# EAGLE board Disco-Cart 2 (EAGLE 9.6.2)
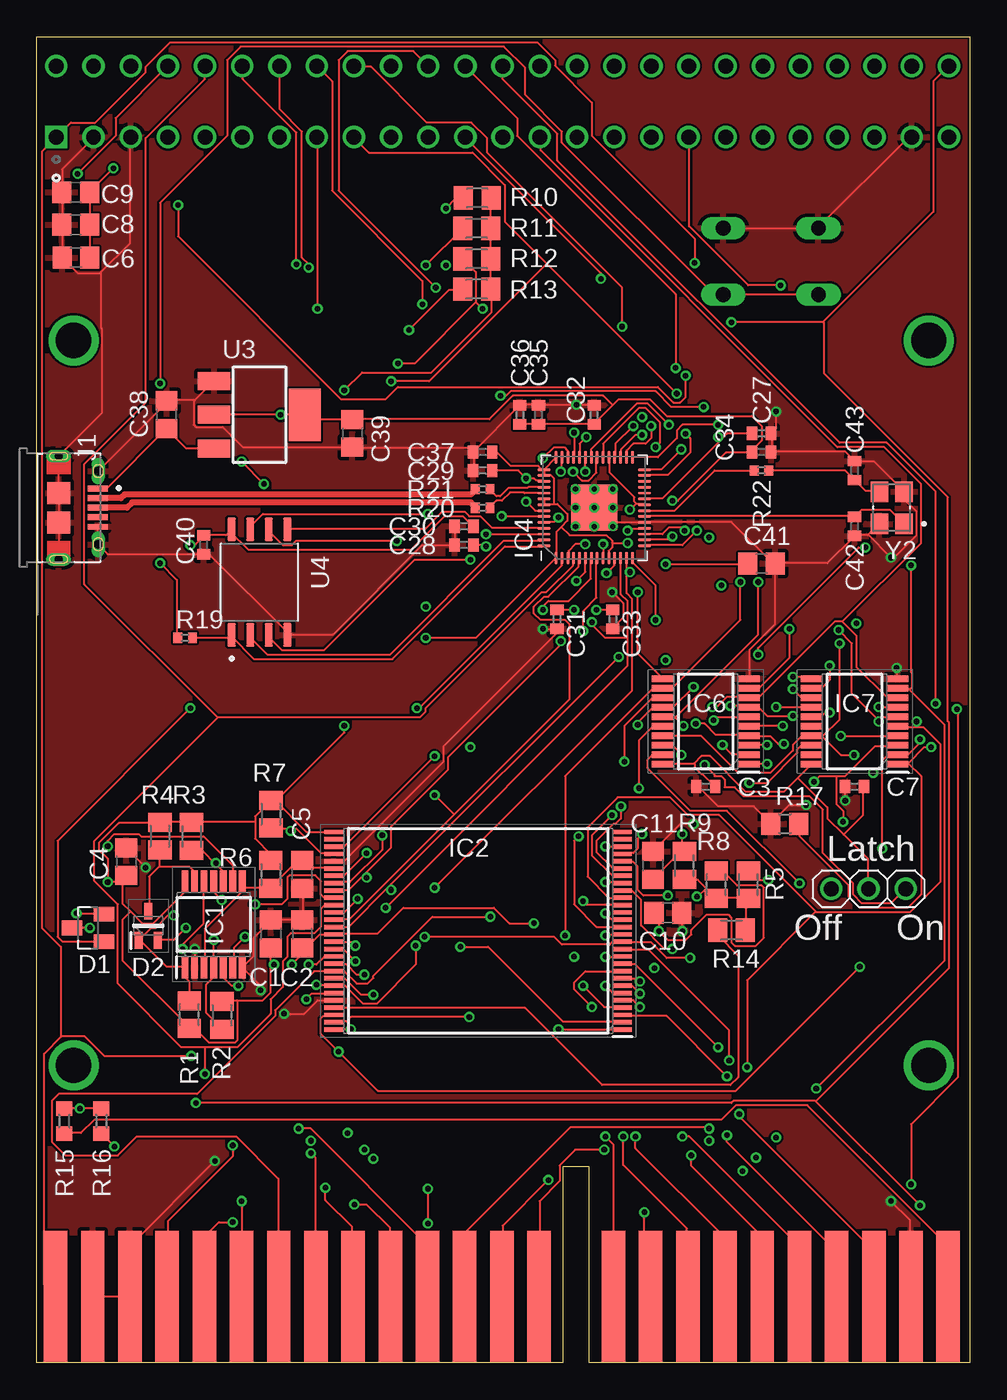
[diagram p3: board, top side]
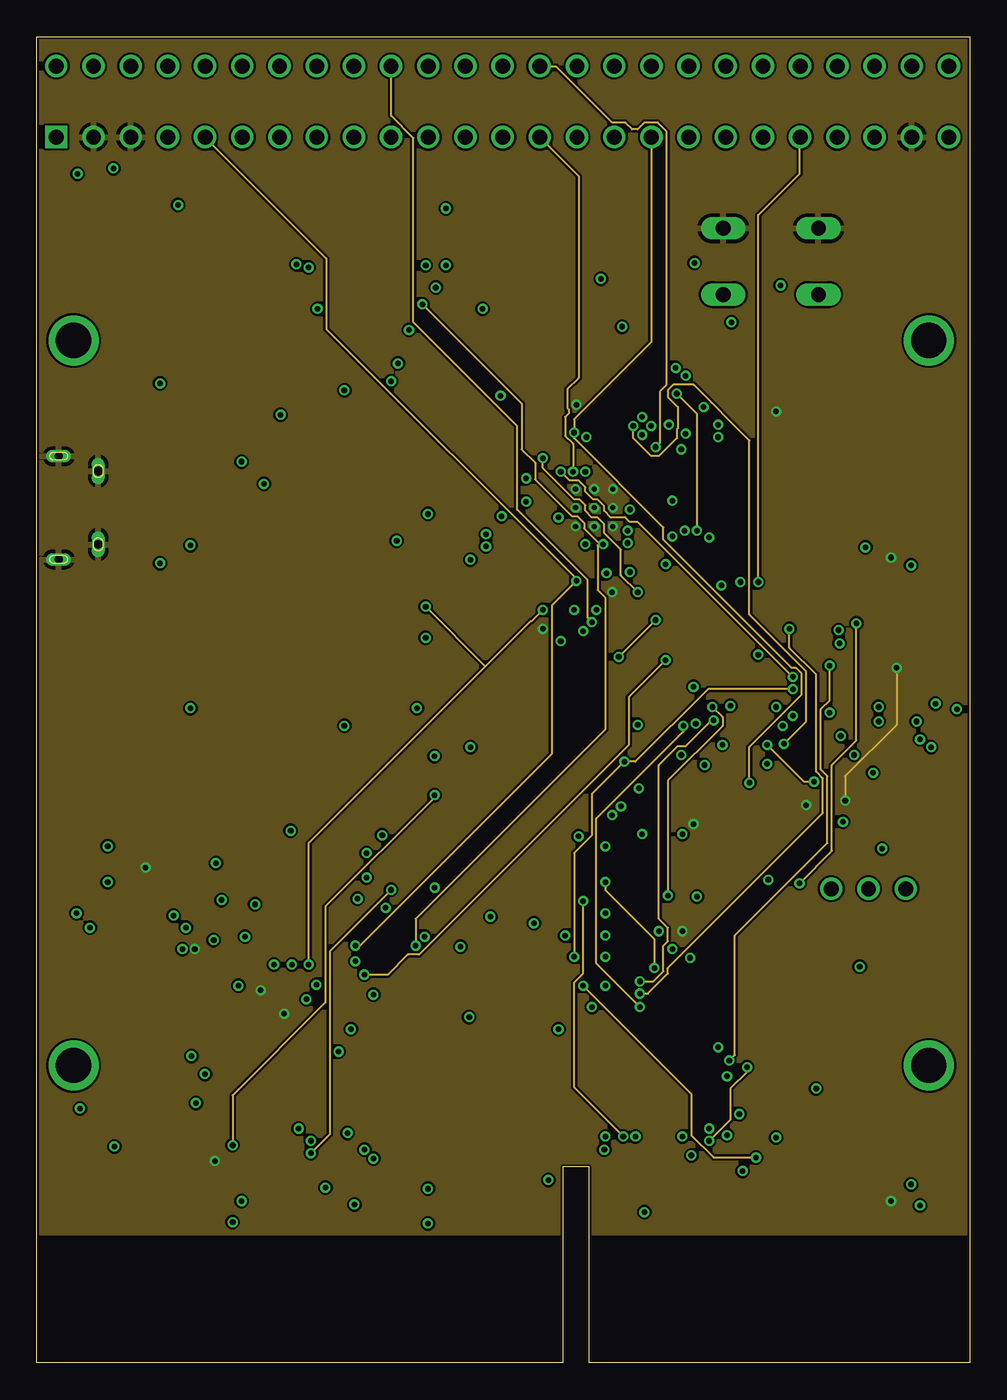
[diagram p4: board, inner layer Route2]
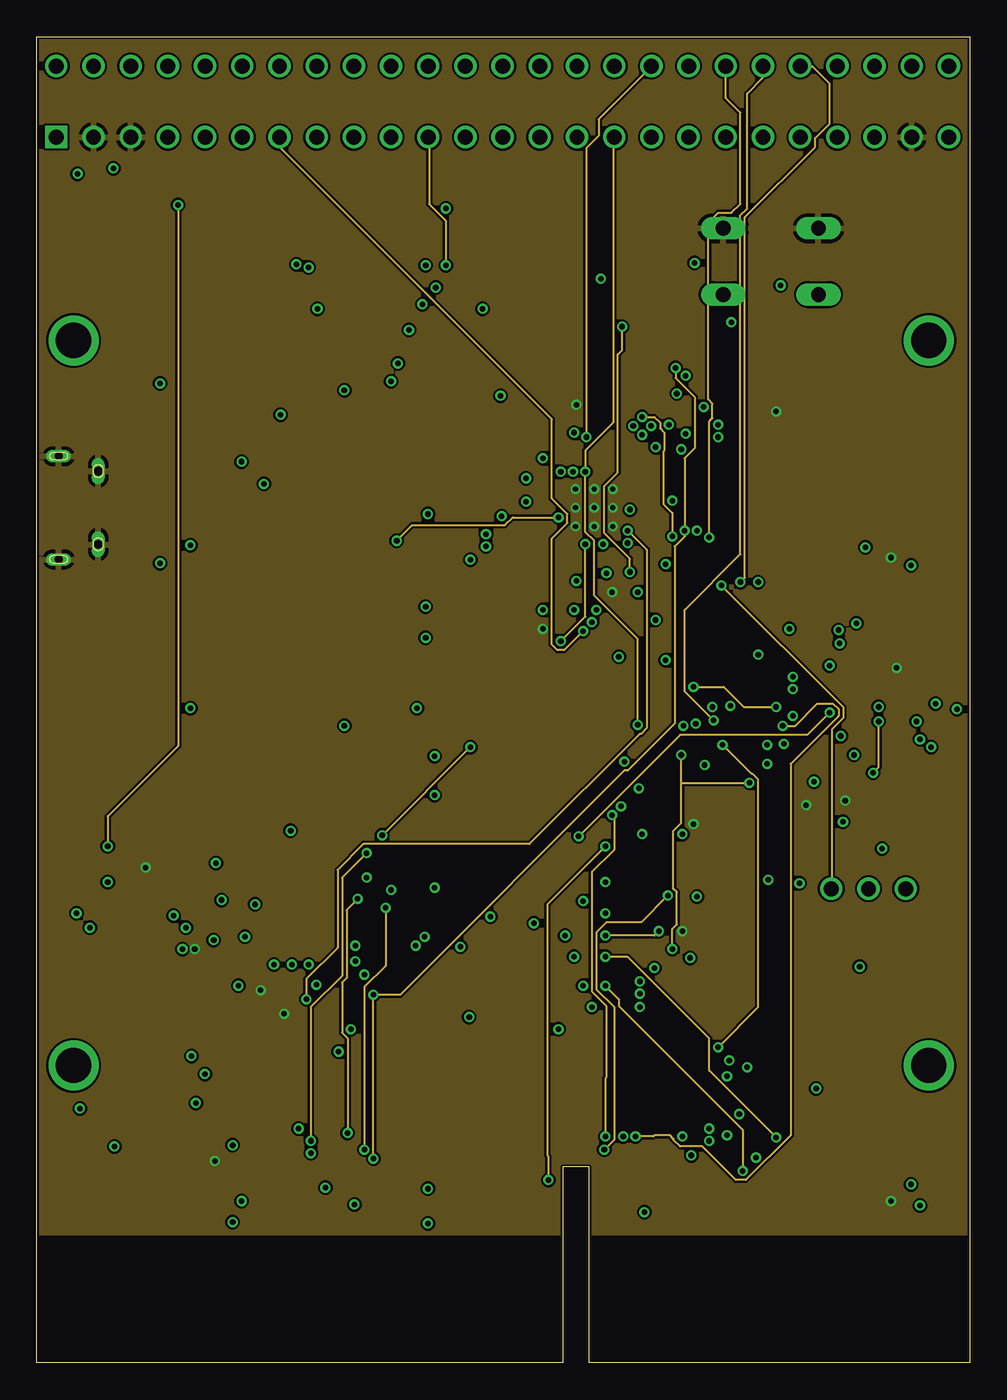
[diagram p5: board, inner layer Route15]
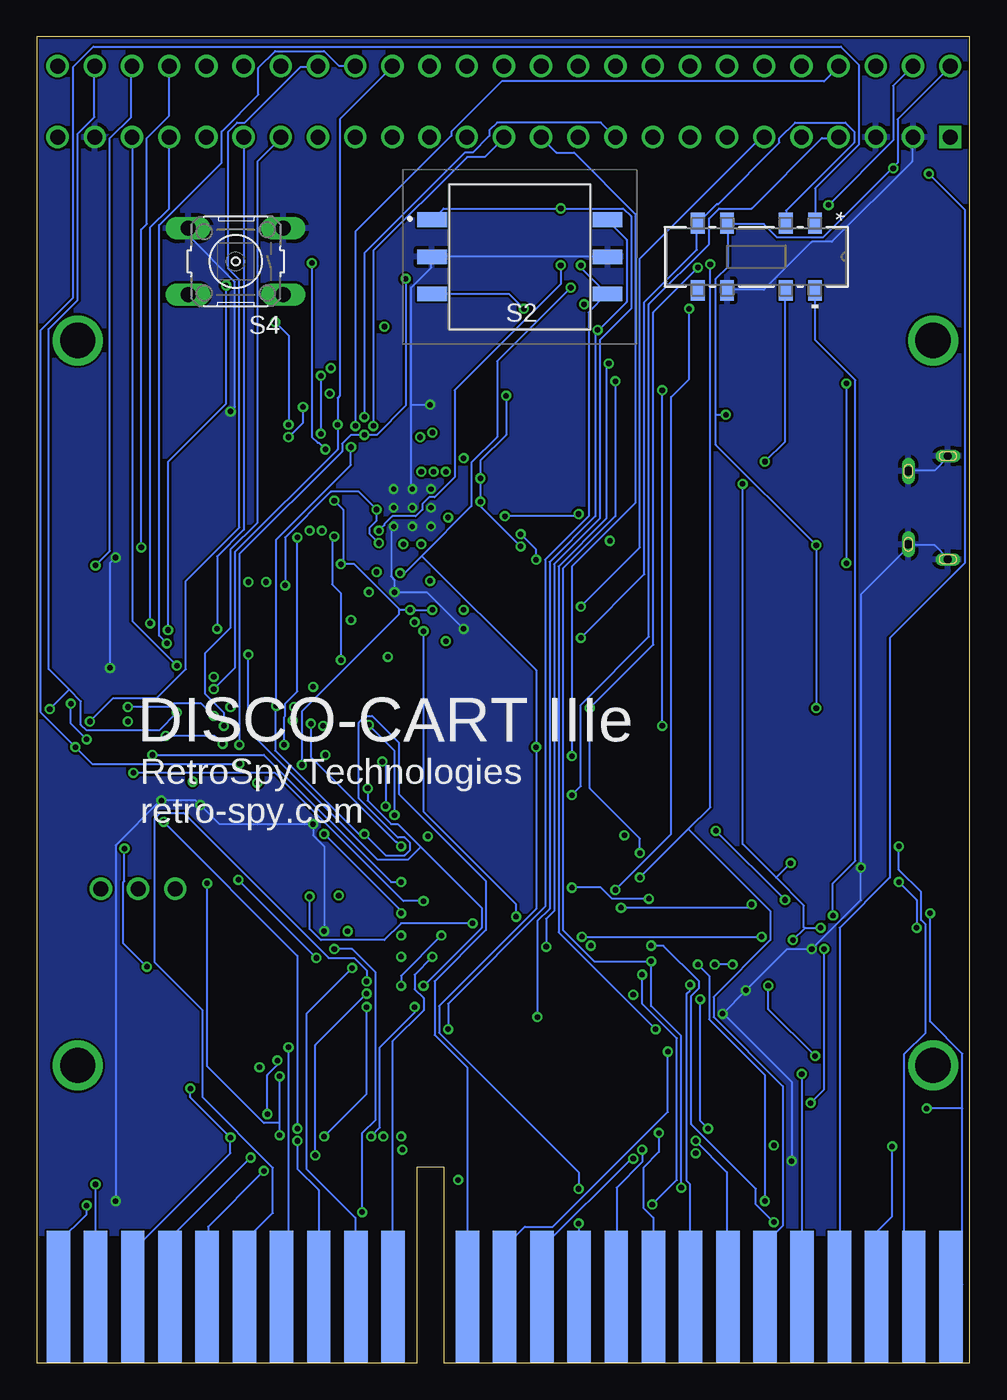
[diagram p6: board, bottom side, seen from below]

Size 63.74 x 90.61 mm. Coordinates in mm from the lower left corner, seen from the top.
Outline: 63.74,0 37.75,0 37.75,13.4 35.95,13.4 35.95,0 0,0 0,90.62 63.74,90.62 63.74,0
Copper layers (1+2*15+16): Top 0.035mm / dielectric 0.11mm / Route2 0.018mm / dielectric 0.6mm / Route15 0.018mm / dielectric 0.11mm / Bottom 0.035mm
Design rules "RetroSpy-2-layer-TIGHT *": minimum track width 6mil, minimum drill 15mil, track to track 6mil, track to pad 6mil, pad to pad 6mil, via to via 6mil, smd to smd 6mil, copper to edge 6mil, drill to drill 6mil, minimum pad ring 6mil, minimum via ring 6mil, stop-mask expansion 4mil, vias tented up to drill 25mil, thermal gap 10mil
Net classes: 1 USB: width 0.406 mm

## Footprints (pad centres in the part's own frame; a part is rotated, then mirrored left to right if it is on the bottom)
C0805 = smd 1.3 x 1.5: 1 -0.95,0; 2 0.95,0
C0402 = smd 0.7 x 0.9: 1 -0.65,0; 2 0.65,0
V.SMILE_CONNECTOR = smd 1.6 x 9: 1 -31.75,0; 2 -29.21,0; 3 -26.67,0; 4 -24.13,0; 5 -21.59,0; 6 -19.05,0; 7 -16.51,0; 8 -13.97,0; 9 -11.43,0; 10 -8.89,0; 11 -6.35,0; 12 -3.81,0; 13 -1.27,0; 14 1.27,0; 15 6.35,0; 16 8.89,0; 17 11.43,0; 18 13.97,0; 19 16.51,0; 20 19.05,0; 21 21.59,0; 22 24.13,0; 23 26.67,0; 24 29.21,0 | smd 1.6 x 9 bottom: 25 -31.75,0; 26 -29.21,0; 27 -26.67,0; 28 -24.13,0; 29 -21.59,0; 30 -19.05,0; 31 -16.51,0; 32 -13.97,0; 33 -11.43,0; 34 -8.89,0; 35 -6.35,0; 36 -3.81,0; 37 -1.27,0; 38 1.27,0; 39 6.35,0; 40 8.89,0; 41 11.43,0; 42 13.97,0; 43 16.51,0; 44 19.05,0; 45 21.59,0; 46 24.13,0; 47 26.67,0; 48 29.21,0
TE_5530843-5 = drill 1.016 square: 1 0,0 | drill 1.016: 2 0,4.851; 3 2.54,0; 4 2.54,4.851; 5 5.08,0; 6 5.08,4.851; 7 7.62,0; 8 7.62,4.851; 9 10.16,0; 10 10.16,4.851; 11 12.7,0; 12 12.7,4.851; 13 15.24,0; 14 15.24,4.851; 15 17.78,0; 16 17.78,4.851; 17 20.32,0; 18 20.32,4.851; 19 22.86,0; 20 22.86,4.851; 21 25.4,0; 22 25.4,4.851; 23 27.94,0; 24 27.94,4.851; 25 30.48,0; 26 30.48,4.851; 27 33.02,0; 28 33.02,4.851; 29 35.56,0; 30 35.56,4.851; 31 38.1,0; 32 38.1,4.851; 33 40.64,0; 34 40.64,4.851; 35 43.18,0; 36 43.18,4.851; 37 45.72,0; 38 45.72,4.851; 39 48.26,0; 40 48.26,4.851; 41 50.8,0; 42 50.8,4.851; 43 53.34,0; 44 53.34,4.851; 45 55.88,0; 46 55.88,4.851; 47 58.42,0; 48 58.42,4.851; 49 60.96,0; 50 60.96,4.851
SOT23 = smd 1 x 1.4: 1 -0.95,-1.1; 2 0.95,-1.1; 3 0,1.1
SOT65P220X100-3N = smd 1.15 x 0.55: 1 -1,0.65; 2 -1,-0.65; 3 1,0
SOP65P640X120-14N = smd 1.475 x 0.45: 1 -2.938,1.95; 2 -2.938,1.3; 3 -2.938,0.65; 4 -2.938,0; 5 -2.938,-0.65; 6 -2.938,-1.3; 7 -2.938,-1.95; 8 2.938,-1.95; 9 2.938,-1.3; 10 2.938,-0.65; 11 2.938,0; 12 2.938,0.65; 13 2.938,1.3; 14 2.938,1.95
SOP50P2000X120-56N = smd 1.3 x 0.3: 1 -9.85,6.75; 2 -9.85,6.25; 3 -9.85,5.75; 4 -9.85,5.25; 5 -9.85,4.75; 6 -9.85,4.25; 7 -9.85,3.75; 8 -9.85,3.25; 9 -9.85,2.75; 10 -9.85,2.25; 11 -9.85,1.75; 12 -9.85,1.25; 13 -9.85,0.75; 14 -9.85,0.25; 15 -9.85,-0.25; 16 -9.85,-0.75; 17 -9.85,-1.25; 18 -9.85,-1.75; 19 -9.85,-2.25; 20 -9.85,-2.75; 21 -9.85,-3.25; 22 -9.85,-3.75; 23 -9.85,-4.25; 24 -9.85,-4.75; 25 -9.85,-5.25; 26 -9.85,-5.75; 27 -9.85,-6.25; 28 -9.85,-6.75; 29 9.85,-6.75; 30 9.85,-6.25; 31 9.85,-5.75; 32 9.85,-5.25; 33 9.85,-4.75; 34 9.85,-4.25; 35 9.85,-3.75; 36 9.85,-3.25; 37 9.85,-2.75; 38 9.85,-2.25; 39 9.85,-1.75; 40 9.85,-1.25; 41 9.85,-0.75; 42 9.85,-0.25; 43 9.85,0.25; 44 9.85,0.75; 45 9.85,1.25; 46 9.85,1.75; 47 9.85,2.25; 48 9.85,2.75; 49 9.85,3.25; 50 9.85,3.75; 51 9.85,4.25; 52 9.85,4.75; 53 9.85,5.25; 54 9.85,5.75; 55 9.85,6.25; 56 9.85,6.75
RP2040-QFN-56 = smd 0.875 x 0.2: 1 -3.438,2.6; 2 -3.438,2.2; 3 -3.438,1.8; 4 -3.438,1.4; 5 -3.438,1; 6 -3.438,0.6; 7 -3.438,0.2; 8 -3.438,-0.2; 9 -3.438,-0.6; 10 -3.438,-1; 11 -3.438,-1.4; 12 -3.438,-1.8; 13 -3.438,-2.2; 14 -3.438,-2.6; 29 3.438,-2.6; 30 3.438,-2.2; 31 3.438,-1.8; 32 3.438,-1.4; 33 3.438,-1; 34 3.438,-0.6; 35 3.438,-0.2; 36 3.438,0.2; 37 3.438,0.6; 38 3.438,1; 39 3.438,1.4; 40 3.438,1.8; 41 3.438,2.2; 42 3.438,2.6 | smd 0.2 x 0.875: 15 -2.6,-3.438; 16 -2.2,-3.438; 17 -1.8,-3.438; 18 -1.4,-3.438; 19 -1,-3.438; 20 -0.6,-3.438; 21 -0.2,-3.438; 22 0.2,-3.438; 23 0.6,-3.438; 24 1,-3.438; 25 1.4,-3.438; 26 1.8,-3.438; 27 2.2,-3.438; 28 2.6,-3.438; 43 2.6,3.438; 44 2.2,3.438; 45 1.8,3.438; 46 1.4,3.438; 47 1,3.438; 48 0.6,3.438; 49 0.2,3.438; 50 -0.2,3.438; 51 -0.6,3.438; 52 -1,3.438; 53 -1.4,3.438; 54 -1.8,3.438; 55 -2.2,3.438; 56 -2.6,3.438 | smd 3.2 x 3.2: 57 0,0 | drill 0.35 pad 0.6: 58 -1.275,1.275; 59 0,1.275; 60 1.275,1.275; 61 -1.275,0; 62 0,0; 63 1.275,0; 64 -1.275,-1.275; 65 0,-1.275; 66 1.275,-1.275
SOP65P640X120-20N = smd 1.475 x 0.45: 1 -2.938,2.925; 2 -2.938,2.275; 3 -2.938,1.625; 4 -2.938,0.975; 5 -2.938,0.325; 6 -2.938,-0.325; 7 -2.938,-0.975; 8 -2.938,-1.625; 9 -2.938,-2.275; 10 -2.938,-2.925; 11 2.938,-2.925; 12 2.938,-2.275; 13 2.938,-1.625; 14 2.938,-0.975; 15 2.938,-0.325; 16 2.938,0.325; 17 2.938,0.975; 18 2.938,1.625; 19 2.938,2.275; 20 2.938,2.925
AMPHENOL_10118194-0001LF = smd 0.4 x 1.35: 1 -1.3,2.675; 2 -0.65,2.675; 3 0,2.675; 4 0.65,2.675; 5 1.3,2.675 | drill 0.6 pad 0.8 long: S1 -2.5,2.7; S2 2.5,2.7 | drill 0.55 pad 0.75 long: S3 -3.525,0; S6 3.525,0 | smd 1.5 x 1.55: S4 -1,0; S5 1,0
1X03 = drill 1.016: 1 -2.54,0; 2 0,0; 3 2.54,0
M0805 = smd 1.3 x 1.6: 1 -0.95,0; 2 0.95,0
R0603 = smd 1 x 1.1: 1 -0.85,0; 2 0.85,0
R0805 = smd 1.3 x 1.5: 1 -0.95,0; 2 0.95,0
R0402 = smd 0.6 x 0.7: 1 -0.5,0; 2 0.5,0
221AMC16R = smd 2 x 1: 1 -6,2.54; 2 6,-2.54; 4 -6,-2.54; 8 6,2.54; C1 -6,0; C2 6,0
B3F-10XX = drill 1.016 long: 1 -3.251,2.261; 2 3.251,2.261; 3 -3.251,-2.261; 4 3.251,-2.261
CL-SB-23B_NDC = smd 1.422 x 0.94: 1 -2.299,4; 2 -2.299,2; 3 -2.299,-2; 4 -2.299,-4; 5 2.299,4; 6 2.299,2; 7 2.299,-2; 8 2.299,-4
SOT223 = smd 1.219 x 2.235: 1 -2.311,-3.099; 2 0,-3.099; 3 2.311,-3.099 | smd 3.6 x 2.2: TAB 0,3.099
SOIC127P790X216-8N = smd 1.61 x 0.58: 1 -3.605,1.905; 2 -3.605,0.635; 3 -3.605,-0.635; 4 -3.605,-1.905; 5 3.605,-1.905; 6 3.605,-0.635; 7 3.605,0.635; 8 3.605,1.905
XTAL_ABM8G-12.000MHZ-4Y-T3 = smd 1.2 x 1.4: 1 -0.85,1.1; 2 -0.85,-1.1; 3 0.85,-1.1; 4 0.85,1.1

## Placement (x,y rotation side)
C1  1uF  [C0805]  16,29.31 90 top
C2  .1uF  [C0805]  18.14,29.31 90 top
C3  .1uF  [C0402]  45.7,39.38 180 top
C4  .1uF  [C0805]  6.13,34.24 90 top
C5  .1uF  [C0805]  18.13,33.37 90 top
C6  10uF  [C0805]  2.69,75.51 180 top
C7  .1uF  [C0402]  55.86,39.38 180 top
C8  1uF  [C0805]  2.67,77.75 180 top
C9  .1uF  [C0805]  2.67,79.97 180 top
C10  .1uF  [C0805]  43.12,30.76 180 top
C11  .1uF  [C0805]  42.1,33.98 270 top
C27  .1uF  [C0402]  49.51,63.51 0 top
C28  .1uF  [C0402]  29.19,55.89 180 top
C29  1uF  [C0402]  30.46,60.97 180 top
C30  .1uF  [C0402]  29.19,57.16 180 top
C31  .1uF  [C0402]  35.54,50.81 270 top
C32  .1uF  [C0402]  38.08,64.78 90 top
C33  .1uF  [C0402]  39.35,50.81 270 top
C34  .1uF  [C0402]  49.51,62.24 0 top
C35  .1uF  [C0402]  34.27,64.78 90 top
C36  .1uF  [C0402]  33,64.78 90 top
C37  1uF  [C0402]  30.46,62.24 180 top
C38  10uF  [C0805]  8.87,64.78 90 top
C39  10uF  [C0805]  21.57,63.51 270 top
C40  .1uF  [C0402]  11.41,55.89 270 top
C41  10uF  [C0805]  49.51,54.62 0 top
C42  15p  [C0402]  55.86,57.16 90 top
C43  15p  [C0402]  55.86,60.97 270 top
CONN1  V.SMILE_CONNECTOR  [V.SMILE_CONNECTOR]  33.05,4.51 0 top
CONN2  5530843-5  [TE_5530843-5]  1.35,83.75 0 top
D1  PMEG2005CT  [SOT23]  3.51,29.72 90 top
D2  MMBD717LT1G  [SOT65P220X100-3N]  7.63,29.86 90 top
IC1  SN74CBTLV3126PW  [SOP65P640X120-14N]  12.1,29.96 90 top
IC2  MT28EW01GABA1HJS-0SIT  [SOP50P2000X120-56N]  30.16,29.52 180 top
IC4  RP2040-QFN56  [RP2040-QFN-56]  38.08,58.43 90 top
IC6  SN74HC373PWR  [SOP65P640X120-20N]  45.7,43.82 180 top
IC7  SN74HC373PWR  [SOP65P640X120-20N]  55.86,43.82 180 top
J1  10118194-0001LF  [AMPHENOL_10118194-0001LF]  1.51,58.43 270 top
JP1  [1X03]  56.81,32.39 0 top
R1  10K  [M0805]  10.42,23.8 270 top
R2  10K  [M0805]  12.65,23.75 90 top
R3  10K  [M0805]  10.58,35.97 90 top
R4  10K  [M0805]  8.42,35.99 90 top
R5  10K  [M0805]  48.61,32.67 270 top
R6  10k  [M0805]  15.99,33.36 90 top
R7  10K  [M0805]  16,37.49 90 top
R8  10K  [M0805]  46.42,32.67 270 top
R9  10K  [M0805]  44.24,33.98 270 top
R10  10K  [M0805]  30.09,79.58 0 top
R11  10K  [M0805]  30.05,77.51 0 top
R12  10K  [M0805]  30.05,75.42 0 top
R13  10K  [M0805]  30.05,73.36 0 top
R14  10K  [M0805]  47.46,29.56 0 top
R15  [R0603]  1.89,16.52 270 top
R16  [R0603]  4.43,16.52 270 top
R17  1k  [R0805]  51.1,36.84 0 top
R19  1k  [R0402]  10.14,49.54 0 top
R20  27  [R0402]  30.46,58.43 180 top
R21  27  [R0402]  30.46,59.7 180 top
R22  1k  [R0402]  49.51,60.97 180 top
S2  221AMC16R  [221AMC16R]  30.75,75.57 0 bottom
S4  [B3F-10XX]  50.15,75.25 180 bottom
SW1  CL-SB-23B-01T  [CL-SB-23B_NDC]  14.59,75.57 270 bottom
U3  NCP1117318H  [SOT223]  15.22,64.78 270 top
U4  W25Q128JVSIM_TR  [SOIC127P790X216-8N]  15.22,53.35 90 top
Y2  ABM8G-12.000MHZ-4Y-T3  [XTAL_ABM8G-12.000MHZ-4Y-T3]  58.4,58.43 180 top

## Tracks (layer width: path | path; a pad name or v marks a point on that pad's centre or on a via)
1OE  (via drill 0.38)
  Top 0.152: v9.36,30.56 8.97,30.56 8.14,29.73 7.83,29.73 6.99,28.89 D2.1 6.99,28.81 7.15,28.81 8.9,27.06 10.12,27.06 IC1.1 10.19,26.98 10.19,26.3 10.42,26.07 10.42,24.77 R1.1
  Bottom 0.152: v9.36,30.56 9.36,32.77 7.83,34.3 7.83,67.14 10.57,69.88 10.57,73.23 SW1.5
2-3OE  (via drill 0.38)
  Top 0.152: 12.21,34.11 11.34,34.98 10.65,34.98 R3.1 | 12.21,34.11 12.71,33.61 12.71,32.92 IC1.10 | v10.19,29.73 9.36,28.89 8.29,28.89 D2.2 | v12.1,28.89 12.1,27.06 IC1.4 12.02,26.98 12.02,26.3 11.56,25.84 11.56,23.93 12.63,22.87 R2.1 | v15.53,60.05 v14,61.58 | v12.25,34.14 12.21,34.11
  Bottom 0.152: v10.19,29.73 11.26,29.73 11.3,29.69 | v12.1,28.89 11.3,29.69 | v14,61.58 12.63,62.95 12.63,73.23 SW1.6 | v15.53,60.05 15.53,35.44 13.24,33.15 | 13.24,33.15 11.34,31.25 11.34,29.73 11.3,29.69 | 13.24,33.15 v12.25,34.14
4OE
  Top 0.152: 8.36,33.92 7.68,33.23 7.68,30.87 D2.3 | 8.36,33.92 8.36,34.98 R4.1 | 8.36,33.92 10.42,33.92 10.73,33.61 10.73,32.92 IC1.13
!BYTE
  Top 0.152: IC2.53 20.33,24.24 33.36,24.24 38.62,18.98 47.38,18.98 47.91,19.51 47.91,27.82 46.54,29.19 46.54,29.5 R14.1
!CE  (via drill 0.38)
  Top 0.152: 17.36,36.51 16.06,36.51 R7.1 | 17.36,36.51 17.74,36.51 19.41,34.83 20.25,34.83 IC2.32 | v12.63,31.63 12.1,32.16 12.1,32.85 IC1.11 | 17.36,36.51 v17.36,36.35
  Bottom 0.152: v17.36,36.35 v12.63,31.63
!LATCH_OE  (via drill 0.38)
  Top 0.152: v61.09,42.07 60.64,42.07 59.53,40.96 | 59.53,40.96 59.49,40.93 58.81,40.93 IC7.1 | v49.89,40.93 48.67,40.93 IC6.1 | 59.53,40.96 60.41,40.09 60.41,32.01 59.49,31.1 56.22,31.1 55.46,31.86 55.46,32.62 52.1,35.97 52.1,36.81 R17.2
  Bottom 0.152: SW1.1 10.57,77.88 10.57,80.25 7.6,83.22 7.6,88.7 8.82,89.92 59.88,89.92 61.25,88.55 61.25,72.78 63.46,70.57 63.46,44.43 v61.09,42.07 59.95,40.93 v49.89,40.93
!OE
  Top 0.152: IC2.34 20.25,33.84 18.65,33.84 18.19,34.3 C5.2 18.12,34.3 17.81,34.3 15.98,32.47 | 14,32.47 14,32.85 IC1.8 14,32.47 | 14,32.47 14,32.16 11.49,29.65 11.49,27.06 IC1.3 | 14,32.47 15.98,32.47 | 15.98,32.47 R6.1
!RST  (via drill 0.38)
  Top 0.152: v38.84,29.19 38.92,29.27 39.99,29.27 IC2.14 | C10.2 42.2,30.72 42.5,30.41 v42.5,29.5 43.11,28.89 44.33,28.89 44.71,29.27 44.71,29.57 45.78,30.64 47.23,30.64 47.46,30.41 47.46,28.73 47.68,28.51 49.13,28.51 49.66,29.04 49.66,32.47 49.51,32.62 47.84,32.62 46.85,33.61 46.46,33.61 R8.1
  Route15 0.152: v38.84,29.19 42.2,29.19 v42.5,29.5
!WE  (via drill 0.38)
  Top 0.152: v44.64,27.67 43.04,27.67 41.97,28.73 40.06,28.73 IC2.13 39.99,28.73 39.3,28.73 39.15,28.58 35.87,28.58 35.34,29.12 v26.5,29.12 | v49.97,33 49.28,33 48.67,33.61 R5.1 | v14.23,29.12 13.47,28.35 13.47,27.06 IC1.6
  Bottom 0.152: v49.97,33 v44.64,27.67 | v26.5,29.12 v14.23,29.12
!WP  (via drill 0.38)
  Top 0.152: v38.84,30.72 39.23,30.34 39.99,30.34 IC2.16 | 44.1,35.06 v44.1,36.13 | 44.1,35.06 44.18,34.98 R9.1 44.1,35.06 | 44.1,35.06 42.12,33.08 C11.2
  Bottom 0.152: v38.84,30.72 38.84,30.87 v44.1,36.13
+1V1  (via drill 0.38)
  Top 0.152: v33.43,58.83 34.04,58.22 34.58,58.22 IC4.50 | IC4.45 34.58,60.28 34.12,60.28 33.97,60.43 v33.43,60.43 32.9,60.97 C29.1 | v30.69,55.78 30.61,55.86 29.85,55.86 C28.1 | 46.73,63.06 47.15,63.48 48.83,63.48 C27.1 | 46.73,63.06 42.73,59.06 41.59,59.06 IC4.23 | v31.68,66.07 32.06,66.07 32.37,66.38 42.27,66.38 43.34,65.31 v45.55,65.31 | 46.73,63.06 v46.54,63.25
  Bottom 0.152: v30.69,55.78 33.43,58.53 v33.43,58.83 v33.43,60.43 33.43,61.65 31.68,63.41 v31.68,66.07 | v45.55,65.31 45.55,64.24 v46.54,63.25
+3V3  (via drill 0.38)
  Top 0.152: 59.27,32.39 JP1.3 58.35,31.4 56.37,31.4 55.76,32.01 55.76,32.77 53.7,34.83 53.7,37.8 52.79,38.72 48.29,38.72 47.68,39.33 47,39.33 47,39.86 46.77,40.09 46.31,40.09 46.31,40.16 v45.63,40.85 | v36.71,51.44 35.57,51.44 C31.1 | v38.23,51.44 39.3,51.44 C33.1 | v42.96,54.57 48.52,54.57 C41.1 | U3.2 v16.67,64.78 U3.TAB 18.35,64.78 18.65,64.47 21.55,64.47 C39.1 21.62,64.47 30.92,64.47 32.52,66.07 38.69,66.07 39.34,65.43 | 32.98,64.09 C36.1 33.05,64.17 34.27,64.17 | 34.27,64.17 38.08,64.17 | 34.27,64.17 C35.1 | 38.08,64.17 39.34,65.43 | 39.34,65.43 39.76,65.84 41.89,65.84 43.04,64.7 48.83,64.7 49.51,64.02 49.51,63.02 48.9,62.41 48.9,62.26 C34.1 48.83,62.19 47.07,62.19 43.8,58.91 v43.42,58.91 | 38.08,64.17 C32.1 | C6.1 3.64,75.52 3.64,77.73 C8.1 3.64,77.81 3.64,79.94 C9.1 3.64,80.02 v5.24,81.62 | C30.1 29.78,57.16 29.09,57.84 27.87,57.84 25.59,55.56 14.46,55.56 13.24,56.78 U4.8 13.32,56.93 12.94,56.55 C40.1 11.41,56.47 10.8,55.86 v10.5,55.86 | v10.5,44.74 1.43,35.67 1.43,29.12 1.74,28.81 4.55,28.81 D1.1
  Bottom 0.152: v36.71,51.44 v38.23,51.44 38.92,51.44 38.96,51.48 | 42.81,54.57 42.04,54.57 38.96,51.48 | 42.81,54.57 42.81,58.3 v43.42,58.91 | 42.81,54.57 v42.96,54.57 | v45.63,40.85 45.63,44.51 39,51.14 39,51.44 38.96,51.48 | 5.28,81.66 4.94,82 4.94,84.97 1.35,88.55 CONN2.2 | 5.28,81.66 10.04,76.89 13.17,76.89 14.08,77.81 16.52,77.81 SW1.3 16.52,77.73 16.52,74.91 17.36,74.07 17.36,64.78 | v5.24,81.62 5.28,81.66 | v10.5,44.74 v10.5,55.86 17.36,62.72 17.36,64.78 | 17.36,64.78 v16.67,64.78
+3V3_LATCH
  Top 0.152: 44.9,40.96 45.4,41.46 46.01,41.46 48.45,39.02 51.04,39.02 51.99,39.97 | 44.9,40.96 44.86,40.93 42.81,40.93 IC6.20 | 51.99,39.97 52.87,40.85 IC7.20 | 55.11,36.09 54.01,37.19 54.01,37.95 51.99,39.97 | 55.11,36.09 56.75,34.45 56.75,32.39 JP1.2 | C3.1 46.31,39.4 45.47,40.24 45.4,40.24 44.94,40.7 44.94,40.93 44.9,40.96 | 55.11,36.09 56.45,37.42 56.45,39.33 C7.1
+3V3_PICO  (via drill 0.38)
  Top 0.152: 40.94,58.72 40.98,58.68 41.51,58.68 IC4.22 | 40.94,58.72 40.83,58.83 40.83,59.14 39.15,60.81 39.15,61.8 IC4.33 | IC4.43 34.65,60.97 34.65,60.66 IC4.44 34.73,60.66 35.11,60.66 35.34,60.43 35.34,58.68 | IC4.42 35.42,61.8 34.65,61.04 IC4.43 | IC4.48 34.65,58.99 34.65,58.68 IC4.49 34.73,58.68 35.34,58.68 | 35.83,57.12 36.25,57.54 36.25,57.99 35.57,58.68 35.34,58.68 | 35.83,57.12 35.49,56.78 35.49,55.02 IC4.1 35.42,54.95 30.01,49.54 v26.58,49.54 | 39.3,56.01 39.3,56.17 38.92,56.55 36.41,56.55 35.83,57.12 | 39.3,56.01 39.3,55.71 39.07,55.48 39.07,55.02 IC4.10 | v40.52,58.3 40.94,58.72 | 39.3,56.01 v40.37,56.01 | C37.1 31.42,62.24 32.37,61.28 34.27,61.28 34.59,60.97 IC4.43
  Route15 0.152: v46.77,53.12 55.08,44.81 55.08,44.05 54.31,43.29 54.31,32.39 JP1.1
  Bottom 0.152: SW1.2 12.56,77.88 12.56,78.72 7.91,83.37 7.91,84.13 8.52,84.74 11.95,84.74 13.01,83.68 13.01,83.37 17.2,79.18 17.28,79.18 18.58,77.88 SW1.4 18.65,77.81 18.65,76.06 22.23,72.47 22.23,53.88 v26.58,49.54 | v40.37,56.01 40.98,56.62 40.98,57.08 40.52,57.54 v40.52,58.3 41.74,59.52 43.65,59.52 46.77,56.39 v46.77,53.12
A0  (via drill 0.38)
  Top 0.152: v41.36,63.41 40.9,63.41 39.91,62.41 39.91,61.88 IC4.31 | v38.54,74.07 38.54,74.45 29.32,83.68 CONN2.23 | v27.19,41.46 21.01,35.29 20.33,35.29 IC2.31 | v49.89,42.22 48.67,42.22 IC6.3 | 54.62,40.09 53.47,40.09 v53.09,39.71 | 54.62,40.09 55.23,40.09 57.28,42.15 58.73,42.15 IC7.3 | CONN1.12 28.93,4.82 28.93,8.58 36.43,16.09 45.85,16.09 v45.93,16.01 | v55.08,36.96 55.08,37.73 54.62,38.18 54.62,40.09
  Route2 0.152: v53.09,39.71 52.41,39.71 v49.89,42.22
  Bottom 0.152: v38.54,74.07 38.54,65.39 40.52,63.41 v41.36,63.41 42.27,63.41 42.88,62.8 42.88,62.26 49.89,55.25 v49.89,42.22 | v27.19,41.46 27.19,54.41 22.84,58.76 22.84,78.49 27.03,82.68 28.25,82.68 29.24,83.68 CONN2.23 | v45.93,16.01 45.93,27.82 v55.08,36.96
A1  (via drill 0.38)
  Top 0.152: v40.75,64.02 39.53,62.8 39.53,61.88 IC4.32 | v38.84,35.29 39.99,35.29 IC2.26 | v45.02,43.67 45.63,43.67 46.39,42.91 48.6,42.91 IC6.4 48.67,42.83 50.12,42.83 50.66,42.3 v51.04,42.3 | v54.92,42.83 58.73,42.83 IC7.4 | v34.96,12.5 31.83,9.38 31.83,4.58 CONN1.13
  Route2 0.152: v40.75,64.02 40.75,63.18 41.97,61.96 42.5,61.96 43.72,63.18 43.72,63.79 43.8,63.86 43.8,65.31 43.11,66 43.11,66.45 43.49,66.83 44.86,66.83 48.67,63.02 48.67,51.14 52.56,47.25 52.56,43.82 v51.04,42.3
  Route15 0.152: v34.96,12.5 34.96,14.1 34.88,14.18 34.88,31.33 v38.84,35.29
  Bottom 0.152: v40.75,64.02 40.75,75.98 34.35,82.38 33.13,82.38 31.83,83.68 CONN2.25 | v38.84,35.29 39.15,35.59 39.23,35.59 45.02,41.38 v45.02,43.67 | v54.92,42.83 51.57,42.83 v51.04,42.3
A2  (via drill 0.38)
  Top 0.152: v42.27,62.57 42.58,62.87 42.58,64.24 41.59,65.23 41.13,65.23 38.69,62.8 38.69,61.88 IC4.34 | v47.38,44.89 48.52,44.89 48.6,44.81 IC6.7 48.67,44.74 49.36,44.74 49.89,44.2 v51.65,44.2 | v41.36,36.13 41.05,35.82 41.05,35.13 40.75,34.83 40.06,34.83 IC2.25 | v57.51,44.81 58.73,44.81 IC7.7
  Route2 0.152: v42.27,62.57 42.58,62.87 42.58,66.38 43.04,66.83 43.04,84.13 42.43,84.74 41.51,84.74 41.05,84.28 40.67,84.28 40.22,84.74 39.3,84.74 35.49,88.55 34.42,88.55 CONN2.28
  Bottom 0.152: v42.27,62.57 42.27,61.35 47.38,56.24 v47.38,44.89 47.46,44.81 47.46,41.84 41.74,36.13 v41.36,36.13 39.91,34.68 38.62,34.68 38.23,35.06 38.23,35.52 38.62,35.9 39.07,35.9 41.74,38.56 41.74,43.75 41.28,44.2 40.83,44.2 39,42.37 39,38.87 33.05,32.92 33.05,29.57 36.56,26.07 36.56,22.41 34.35,20.2 34.35,4.58 CONN1.38 | v57.51,44.81 54.62,44.81 54.39,45.04 52.48,45.04 v51.65,44.2
A3  (via drill 0.38)
  Top 0.152: v36.63,60.89 37.24,60.28 37.7,60.28 38.23,60.81 38.23,61.8 IC4.35 | v43.11,31.94 41.44,31.94 41.05,32.32 41.05,33.92 40.75,34.22 40.06,34.22 IC2.24 | v46.16,44.81 46.46,44.81 47.15,45.5 48.6,45.5 IC6.8 48.67,45.5 49.36,45.5 54.54,50.68 55,50.68 55.04,50.64 | 55.04,50.64 55.99,49.69 55.99,47.56 58.05,45.5 58.73,45.5 IC7.8 | v38.77,14.56 36.79,14.56 35.72,13.49 35.72,12.43 34.35,11.06 34.35,4.58 CONN1.14 | 55.04,50.64 60.41,56.01 60.41,60.05 57.89,62.57 54.69,62.57 34.42,82.84 34.42,83.68 CONN2.27
  Route2 0.152: v36.63,60.89 36.63,62.8 36.1,63.33 36.1,64.62 36.33,64.85 36.33,65.16 36.25,65.23 36.25,66.53 37.02,67.29 37.02,81.08 34.42,83.68 CONN2.27 | v43.11,31.94 43.11,39.78 46.85,43.52 46.85,44.13 v46.16,44.81
  Route15 0.152: v38.77,14.56 39.45,15.25 39.45,24.32 38.23,25.53 38.23,29.42 38.92,30.11 41.28,30.11 v43.11,31.94
A4  (via drill 0.38)
  Top 0.152: v39.91,38.03 39.91,37.19 39.53,36.81 39.38,36.81 38.23,35.67 38.23,34.91 39.3,33.84 39.99,33.84 IC2.23 | v40.14,41.08 40.14,43.52 42.04,45.42 42.73,45.42 IC6.13 | v43.19,64.09 41.74,65.54 40.98,65.54 37.85,62.41 37.85,61.88 IC4.36 | v51.65,46.03 52.18,45.5 52.87,45.5 IC7.13
  Route2 0.152: v51.65,46.03 45.85,46.03 40.9,41.08 v40.14,41.08 37.93,38.87 37.93,36.05 36.71,34.83 v36.71,27.74
  Bottom 0.152: v39.91,38.03 39.91,40.85 v40.14,41.08 | CONN2.32 39.45,88.55 43.04,84.97 43.04,66.07 43.19,65.92 v43.19,64.09 43.19,62.41 50.2,55.4 50.2,47.48 v51.65,46.03 | v36.71,27.74 37.93,26.53 37.93,25.53 37.32,24.92 37.32,24.09 39.45,21.95 39.45,4.58 CONN1.39
A5  (via drill 0.38)
  Top 0.152: v37.47,60.89 37.47,61.8 IC4.37 | v39.3,37.42 37.93,36.05 37.93,34.68 39.3,33.31 39.99,33.31 IC2.22 | v41.05,43.59 41.05,43.75 42.04,44.74 42.73,44.74 IC6.14 42.81,44.81 43.49,44.81 v44.86,46.18 | v50.5,44.81 52.87,44.81 IC7.14 | v38.84,15.48 39.38,14.94 39.38,4.58 CONN1.15
  Route15 0.152: CONN2.31 39.38,83.68 39.38,64.24 37.47,62.34 v37.47,60.89 37.47,56.78 38.08,56.17 38.08,52.43 41.05,49.46 v41.05,43.59 | v50.5,44.81 48.29,44.81 46.92,46.18 v44.86,46.18 | v38.84,15.48 38.84,19.44 38.92,19.51 38.92,24.39 37.93,25.38 37.93,33.53 39.45,35.06 39.45,37.27 v39.3,37.42
  Bottom 0.152: v39.3,37.42 39.3,41.84 v41.05,43.59
A6  (via drill 0.38)
  Top 0.152: v37.55,63.25 37.09,62.8 37.09,61.88 IC4.38 | v38.84,32.85 39.99,32.85 IC2.21 | v55.84,41.54 54.92,41.54 53.67,42.79 | 53.67,42.79 53.63,42.83 52.94,42.83 IC7.17 52.87,42.83 52.26,42.83 51.65,42.22 51.65,41.84 50.12,40.32 47.91,40.32 45.4,42.83 42.81,42.83 IC6.17 | v54.85,49.16 54.85,43.97 53.67,42.79
  Route2 0.152: v42.2,26.98 42.2,28.96 38.84,32.32 v38.84,32.85
  Route15 0.152: v37.55,63.25 37.55,82.99 38.39,83.83 38.39,84.97 41.97,88.55 CONN2.34
  Bottom 0.152: v38.84,32.85 39.53,32.85 48.22,41.54 v55.84,41.54 | v42.2,26.98 45.32,23.86 45.32,13.27 41.97,9.91 41.97,4.58 CONN1.40 | v54.85,49.16 55.38,49.69 55.38,77.73 51.11,82 51.11,84.13 48.6,86.65 48.6,88.48 47.46,89.62 44.1,89.62 43.11,88.63 42.04,88.63 CONN2.34
A7  (via drill 0.38)
  Top 0.152: v36.71,63.56 36.71,61.88 IC4.39 | v43.42,28.28 42.88,28.28 41.28,29.88 41.28,31.63 40.67,32.24 40.06,32.24 IC2.20 | v41.51,10.29 41.51,4.96 41.89,4.58 CONN1.16 | v44.03,41.54 44.03,41.61 43.49,42.15 42.81,42.15 IC6.18 | v48.67,39.63 49.89,39.63 51.95,41.69 51.95,41.92 52.18,42.15 52.87,42.15 IC7.18
  Route2 0.152: CONN2.33 41.97,83.68 41.97,69.73 36.71,64.47 v36.71,63.56 36.71,63.18 42.81,57.08 42.81,56.24 51.57,47.48 51.87,47.48 52.26,47.1 52.26,45.65 48.67,42.07 v48.67,39.63
  Route15 0.152: 44.03,39.63 44.03,36.89 43.49,36.35 43.49,32.39 43.72,32.16 43.72,29.95 43.42,29.65 v43.42,28.28 | 44.03,39.63 v44.03,41.54 | 44.03,39.63 v48.67,39.63
  Bottom 0.152: v43.42,28.28 42.2,28.28 40.6,26.68 40.6,16.62 41.51,15.7 v41.51,10.29
A8  (via drill 0.38)
  Top 0.152: v46.54,21.57 40.9,27.21 40.06,27.21 IC2.10 | v46.85,42.22 47.46,41.61 48.6,41.61 IC6.2
  Route15 0.152: v46.85,42.22 48.83,40.24 48.9,40.24 49.28,39.86 49.28,24.32 v46.54,21.57 | v45.93,56.39 45.93,64.32 46.16,64.55 46.16,65.54 45.85,65.84 45.85,77.88 46.54,78.57 47.46,78.57 48.06,79.18 48.06,85.43 47.07,86.42 47.07,88.55 CONN2.38
  Bottom 0.152: v46.54,21.57 46.54,5.04 47,4.58 CONN1.42 | v45.93,56.39 45.93,45.88 46.77,45.04 46.77,44.2 46.85,44.13 v46.85,42.22
A9  (via drill 0.38)
  Top 0.152: v37.93,24.32 36.71,25.53 36.71,25.99 37.47,26.75 39.99,26.75 IC2.9 | v40.9,15.48 40.9,14.67 47,8.58 47,4.58 CONN1.18 | v50.96,43.52 48.67,43.52 IC6.5
  Route15 0.152: v40.9,15.48 42.12,15.48 42.2,15.55 43.26,15.55 43.49,15.32 43.49,15.25 43.95,14.79 45.47,14.79 47.76,12.5 48.45,12.5 51.49,15.55 51.49,40.93 54.77,44.2 54.77,44.66 54.39,45.04 53.32,45.04 51.8,43.52 v50.96,43.52
  Bottom 0.152: v37.93,24.32 37.93,23.93 40.29,21.57 40.29,16.09 v40.9,15.48 | v50.96,43.52 50.96,44.43 52.26,45.73 52.26,48.47 50.5,50.22 50.5,55.56 48.67,57.39 48.67,82.07 47.07,83.68 CONN2.37
A10  (via drill 0.38)
  Top 0.152: v41.21,26.07 41.05,26.22 40.06,26.22 IC2.8 | v46.24,43.9 46.46,44.13 48.6,44.13 IC6.6
  Route2 0.152: v46.24,43.9 46.08,43.9 44.33,42.15 43.8,42.15 42.5,40.85 42.5,30.34 43.11,29.73 43.11,28.81 42.81,28.51 42.81,26.75 42.12,26.07 v41.21,26.07
  Route15 0.152: v46.24,43.9 44.25,45.88 44.25,51.44 48.06,55.25 48.06,78.42 48.52,78.87 48.52,86.72 49.59,87.79 49.59,88.55 CONN2.40
  Bottom 0.152: v41.21,26.07 41.21,26.83 42.04,27.67 43.8,27.67 53.7,37.57 55.3,37.57 55.68,37.19 55.68,27.36 52.41,24.09 52.41,18.14 47.61,13.34 47.61,10.24 49.51,8.34 49.51,4.58 CONN1.43
A11  (via drill 0.38)
  Top 0.152: v51.42,50.15 51.42,48.16 49.36,46.11 48.67,46.11 IC6.9 | v41.21,25.23 40.67,25.76 40.06,25.76 IC2.7 | v44.71,14.18 44.71,13.46 49.51,8.66 49.51,4.58 CONN1.19
  Route2 0.152: v51.42,50.15 51.42,48.85 53.25,47.02 53.25,40.39 53.7,39.94 53.7,37.57 43.11,26.98 43.11,26.6 41.74,25.23 v41.21,25.23
  Bottom 0.152: v51.42,50.15 51.42,55.1 49.59,56.93 49.59,83.68 CONN2.39 | v41.21,25.23 44.71,21.72 v44.71,14.18
A12  (via drill 0.38)
  Top 0.152: v38.84,25.76 39.3,25.3 39.99,25.3 IC2.6 | v36.1,29.19 36.1,40.09 42.04,46.03 42.73,46.03 IC6.12 42.81,46.11 43.42,46.11 48.06,50.76 v48.06,53.35
  Route15 0.152: v48.06,53.35 48.37,53.65 48.37,78.26 53.17,83.07 53.17,83.68 54.16,84.67 54.16,87.41 53.02,88.55 52.18,88.55 CONN2.42 | v48.22,13.11 48.22,15.93 39.76,24.39 39.76,24.85 v38.84,25.76
  Bottom 0.152: v38.84,25.76 38.84,26.45 v36.1,29.19 | v48.22,13.11 52.03,9.3 52.03,4.58 CONN1.44
A13  (via drill 0.38)
  Top 0.152: v41.21,24.32 40.75,24.77 40.06,24.77 IC2.5 | v44.1,15.48 44.57,15.48 52.03,8.02 52.03,4.58 CONN1.20 | v44.18,43.52 43.61,44.09 | 43.61,44.09 43.57,44.13 42.81,44.13 IC6.15 | v49.28,53.35 49.28,49.77 43.61,44.09
  Route2 0.152: v44.18,43.52 44.18,43.14 38.23,37.19 38.23,27.29 v41.21,24.32 | v49.28,53.35 49.28,78.42 52.1,81.24 52.1,83.68 CONN2.41
  Bottom 0.152: v41.21,24.32 41.21,18.37 v44.1,15.48
A14  (via drill 0.38)
  Top 0.152: v37.32,25.76 38.77,24.32 39.99,24.32 IC2.4 | v41.13,39.25 41.13,42.53 42.04,43.44 42.73,43.44 IC6.16 | v56.6,55.71 56.14,55.71 49.28,48.85 v49.28,48.39
  Route2 0.152: v49.13,14.03 46.24,14.03 44.71,15.55 44.71,18.37 v37.32,25.76
  Bottom 0.152: v37.32,25.76 33.36,29.73 33.36,31.1 37.51,35.25 | 37.51,35.25 39.07,36.81 39.53,36.81 41.13,38.41 v41.13,39.25 | v56.6,55.71 56.6,77.43 56.22,77.81 56.22,83.68 54.69,85.2 54.69,88.55 CONN2.44 | v49.28,48.39 49.28,43.21 40.44,34.37 38.39,34.37 37.51,35.25 | v49.13,14.03 54.62,8.54 54.62,4.58 CONN1.45
A15  (via drill 0.38)
  Top 0.152: v47.15,19.59 43.04,23.71 40.06,23.71 IC2.3 | v47.15,15.55 47.15,15.09 54.62,7.63 54.62,4.58 CONN1.21 | v52.1,32.77 47.15,37.73 44.64,37.73 41.74,40.62 41.74,41.23 42.04,41.54 42.73,41.54 IC6.19
  Route2 0.152: v55.99,50.53 55.99,42.53 54.31,40.85 54.31,34.98 v52.1,32.77
  Bottom 0.152: v47.15,15.55 47.15,16.39 | 47.15,16.39 v47.15,19.59 | v52.1,32.77 52.1,20.28 48.22,16.39 47.15,16.39 | v55.99,50.53 55.99,77.58 54.69,78.87 54.69,83.68 CONN2.43
A16  (via drill 0.38)
  Top 0.152: IC2.54 20.25,23.71 19.57,23.71 19.41,23.55 19.41,22.49 v20.63,21.27 23.3,18.6 47.76,18.6 v56.22,27.06 | v57.74,35.13 57.74,41.16 58.12,41.54 58.73,41.54 IC7.2 58.81,41.61 59.57,41.61 60.33,42.37 v60.33,42.6 | v61.4,45.04 61.4,59.52 58.05,62.87 54.85,62.87 35.57,82.15 35.57,83.98 31.83,87.71 31.83,88.55 CONN2.26
  Bottom 0.152: v20.63,21.27 20.63,17.15 28.48,9.3 30.4,9.3 31.76,7.94 31.76,4.58 CONN1.37 | v57.74,35.13 57.74,32.92 57.82,32.85 57.82,28.66 v56.22,27.06 | v61.4,45.04 61.4,43.67 v60.33,42.6
A17  (via drill 0.38)
  Top 0.152: 53.21,30.83 53.25,30.79 59.65,30.79 61.7,32.85 61.7,42.3 60.56,43.44 60.1,43.44 | 53.21,30.83 46.62,37.42 44.48,37.42 43.26,38.64 39.68,38.64 37.63,36.58 37.63,33.23 39.07,31.78 39.99,31.78 IC2.19 | 60.1,43.44 58.81,43.44 IC7.5 | 60.1,43.44 v60.1,43.82 | v48.52,20.2 48.52,26.14 53.21,30.83
  Route2 0.152: v45.93,15.17 47.38,16.62 47.38,18.75 48.52,19.9 v48.52,20.2
  Bottom 0.152: v60.1,43.82 58.5,45.42 55.53,45.42 53.55,47.4 53.55,53.42 49.89,57.08 49.89,74 50.66,74.76 50.66,84.13 50.05,84.74 49.51,84.74 45.7,88.55 44.56,88.55 CONN2.36 | v45.93,15.17 45.93,13.27 44.48,11.82 44.48,4.58 CONN1.41
A18  (via drill 0.38)
  Top 0.152: v37.32,31.55 37.55,31.33 39.99,31.33 IC2.18 | v40.06,15.48 40.06,13.53 44.41,9.19 44.41,4.58 CONN1.17 | IC7.6 58.73,44.13 57.82,44.13 v57.51,43.82 57.51,43.9 55.68,45.73 55.68,49.16 v54.77,50.07 | v50.81,73.62 48.6,73.62 44.56,77.66 44.56,83.68 CONN2.35
  Route2 0.152: v37.32,31.55 37.32,26.6 36.71,25.99 36.71,18.83 v40.06,15.48
  Route15 0.152: v57.51,43.82 57.51,40.7 v57.13,40.32
  Bottom 0.152: v57.13,40.32 47.46,40.32 38.69,31.55 v37.32,31.55 | v50.81,73.62 50.81,65.54 54.77,61.58 v54.77,50.07
A19  (via drill 0.38)
  Top 0.152: v38.84,27.74 39.99,27.74 IC2.11 | 59.61,45.99 62.01,43.59 62.01,27.52 v53.25,18.75 | 59.61,45.99 59.57,46.03 58.81,46.03 IC7.9 | v59.72,54.49 59.72,47.17 59.8,47.1 59.8,46.18 59.61,45.99
  Route15 0.152: v38.84,27.74 40.37,27.74 45.93,22.18 45.93,19.97 v50.5,15.4
  Bottom 0.152: CONN1.46 57.13,4.58 57.13,7.7 50.5,14.33 v50.5,15.4 53.25,18.14 v53.25,18.75 | v59.72,54.49 58.73,55.48 58.73,83.68 57.28,85.12 57.28,88.55 CONN2.46
A20  (via drill 0.38)
  Top 0.152: v54.16,47.63 54.16,46.64 53.63,46.11 52.94,46.11 IC7.12 | v47.3,20.66 47.3,22.71 41.82,28.2 40.06,28.2 IC2.12 | v47.99,17 47.99,16.85 56.82,8.02 56.82,5.08 CONN1.22
  Route2 0.152: v54.16,47.63 54.16,45.27 53.55,44.66 53.55,40.54 54.01,40.09 54.01,35.52 47.68,29.19 47.68,21.04 v47.3,20.66
  Bottom 0.152: v54.16,47.63 57.21,50.68 57.21,83.68 CONN2.45 | v47.3,20.66 47.3,20.35 47.99,19.67 v47.99,17
A21  (via drill 0.38)
  Top 0.152: v37.02,35.97 36.71,35.67 36.71,31.33 38.23,29.8 39.99,29.8 IC2.15 | v54.16,44.43 53.86,44.43 53.63,44.2 52.94,44.2 IC7.15 | v59.72,12.2 59.72,16.31 62.92,19.51 62.92,44.58 v62.85,44.66
  Route15 0.152: v37.02,35.97 43.95,42.91 52.64,42.91 v54.16,44.43
  Bottom 0.152: 61.51,45.99 60.71,45.19 60.71,43.59 60.33,43.21 55.38,43.21 v54.16,44.43 | 61.51,45.99 62.92,47.4 62.92,70.64 60.94,72.63 60.94,83.98 59.8,85.12 59.8,88.55 CONN2.48 | v59.72,12.2 59.72,4.58 CONN1.47 | 61.51,45.99 v62.85,44.66
A22  (via drill 0.38)
  Top 0.152: v28.94,28.43 30.84,28.43 35.95,23.32 39.99,23.32 IC2.2 | v27.95,78.87 28.63,79.56 29.09,79.56 R10.1
  Bottom 0.152: v28.94,28.43 28.94,30.34 28.41,30.87 28.41,54.57 25.28,57.69 25.28,69.88 23.15,72.02 23.15,78.34 23.68,78.87 v27.95,78.87 35.95,78.87 36.71,78.11 S2.1
A23  (via drill 0.38)
  Top 0.152: v35.64,22.79 39.99,22.79 IC2.1 | v26.58,74.99 29.09,77.5 R11.1
  Bottom 0.152: v35.64,22.79 35.64,24.54 29.01,31.17 29.01,54.87 26.04,57.84 26.04,71.79 24.82,73.01 S2.2 24.82,73.08 26.58,74.84 v26.58,74.99
A24  (via drill 0.38)
  Top 0.152: v21.47,22.79 20.33,22.79 IC2.56 | v24.67,68.28 25.81,68.28 30.01,72.47 | 30.01,72.47 30.01,74.53 29.17,75.37 R12.1 | 30.01,72.47 v30.46,72.02
  Bottom 0.152: v21.47,22.79 28.1,29.42 28.1,54.41 24.82,57.69 24.82,68.13 v24.67,68.28 | v30.46,72.02 31.45,73.01 36.71,73.01 S2.4
A25  (via drill 0.38)
  Top 0.152: v29.55,23.63 21.47,23.63 21.17,23.32 20.33,23.32 IC2.55 | v25.43,70.57 28.18,73.31 29.09,73.31 R13.1
  Bottom 0.152: v29.55,23.63 29.55,30.18 28.71,31.02 28.71,54.72 25.59,57.84 25.59,70.34 25.4,70.53 | 25.4,70.53 23.45,72.47 23.45,76.74 24.75,78.04 S2.8 | v25.43,70.57 25.4,70.53
DQ0  (via drill 0.38)
  Top 0.152: v25.97,44.74 26.12,44.74 35.87,54.49 35.87,54.95 IC4.2 | v22.54,34.83 21.01,33.31 20.33,33.31 IC2.35 | v18.58,74.84 18.58,75.06 18.12,75.52 18.12,84.13 16.59,85.66 16.59,88.55 CONN2.14
  Route15 0.152: v18.73,15.17 18.73,24.32 20.86,26.45 20.86,33.15 v22.54,34.83
  Bottom 0.152: v22.54,34.83 22.54,35.82 25.97,39.25 v25.97,44.74 21.62,49.08 21.62,71.79 v18.58,74.84 | v18.73,15.17 16.59,13.04 16.59,4.58 CONN1.31
DQ1  (via drill 0.38)
  Top 0.152: v37.47,55.94 36.79,55.94 36.33,55.48 36.33,55.02 IC4.3 | v35.8,49.31 35.8,49.08 28.1,41.38 28.1,40.54 24.21,36.66 24.21,35.21 22.35,33.34 | 22.35,33.34 21.32,32.32 20.33,32.32 IC2.37 | v17.74,75.06 17.74,84.06 14.08,87.71 14.08,88.55 CONN2.12 | 22.35,33.34 v22.54,33.15
  Route15 0.152: v37.47,55.94 37.47,50.98 v35.8,49.31
  Bottom 0.152: v17.74,75.06 17.74,37.95 19.22,36.47 | v22.54,33.15 19.22,36.47 | 19.22,36.47 13.62,30.87 13.62,28.89 17.51,25 17.51,23.63 12.78,18.91 12.78,9.38 13.93,8.24 13.93,4.58 CONN1.30
DQ2  (via drill 0.38)
  Top 0.152: 12.37,44.09 3.94,35.67 3.94,32.92 5.55,31.33 5.55,25.92 9.89,21.57 11.49,21.57 | 12.37,44.09 12.4,44.13 26.2,44.13 26.58,44.51 26.58,44.74 34.5,52.66 34.81,52.66 36.63,54.49 36.63,54.95 IC4.4 | 11.49,21.57 13.7,21.57 15.98,23.86 15.98,24.85 16.82,25.69 16.82,27.44 17.13,27.74 17.13,29.12 17.36,29.34 18.96,29.34 19.41,29.8 19.41,31.02 19.64,31.25 20.25,31.25 IC2.39 | 12.37,44.09 3.26,53.2 3.26,61.42 7.45,65.62 7.45,83.68 11.49,87.71 11.49,88.55 CONN2.10 | 11.49,21.57 v11.49,19.74
  Bottom 0.152: v11.49,19.74 11.49,4.58 CONN1.29
DQ3  (via drill 0.38)
  Top 0.152: 28.52,37.46 21.39,30.34 20.33,30.34 IC2.41 | 28.52,37.46 36.41,45.35 36.41,50.45 36.1,50.76 34.42,50.76 33.97,51.21 33.97,51.67 34.65,52.36 34.96,52.36 37.02,54.41 37.02,54.95 IC4.5 | 28.52,37.46 v27.19,38.79 | v13.39,14.87 13.39,14.1 8.97,9.68 8.97,4.58 CONN1.4
  Route2 0.152: v13.39,14.87 13.39,18.3 19.72,24.62 19.72,31.17 27.19,38.64 v27.19,38.79
  Bottom 0.152: v27.19,38.79 26.58,39.4 26.58,44.96 21.93,49.61 21.93,72.32 17.81,76.44 17.81,78.19 17.13,78.87 14.92,78.87 10.12,83.68 8.97,83.68 CONN2.7
DQ4  (via drill 0.38)
  Top 0.152: v21.78,28.51 21.55,28.73 20.33,28.73 IC2.44 | v13.39,9.61 12.44,9.61 11.49,8.66 11.49,4.58 CONN1.5 | v36.86,53.42 37.47,54.03 37.47,54.95 IC4.6
  Route2 0.152: CONN2.9 11.56,83.68 19.79,75.45 19.79,70.64 36.86,53.58 v36.86,53.42 35.19,51.75 35.19,41.61 22.08,28.51 v21.78,28.51
  Bottom 0.152: v21.78,28.51 20.94,28.51 18.5,26.07 18.5,25.61 19.03,25.08 19.03,16.31 14.61,11.89 14.61,10.83 v13.39,9.61
DQ5  (via drill 0.38)
  Top 0.152: v34.58,51.44 34.58,51.67 34.96,52.05 36.33,52.05 37.85,53.58 37.85,54.95 IC4.7 | v18.58,27.21 19.11,27.21 19.64,27.74 20.25,27.74 IC2.46 | v14,11.06 14,4.58 CONN1.6
  Route2 0.152: v34.58,51.44 33.82,50.68 33.74,50.68 30.65,47.59 | 30.65,47.59 18.58,35.52 v18.58,27.21 | 30.65,47.59 v26.58,51.67
  Bottom 0.152: v26.58,51.67 22.54,55.71 22.54,75.45 14.31,83.68 14.08,83.68 CONN2.11 | v14,11.06 14,19.67 17.81,23.48 17.81,26.45 v18.58,27.21
DQ6  (via drill 0.38)
  Top 0.152: v37.32,49.99 37.32,51.37 38.23,52.28 38.23,54.95 IC4.8 | v31,30.49 27.03,30.49 22.99,26.45 22.99,26.3 22.61,25.92 21.85,25.92 21.01,26.75 20.33,26.75 IC2.48 20.25,26.75 18.96,26.75 16.29,24.09 16.29,23.71 10.96,18.37 1.51,18.37 1.05,17.91 1.05,15.09 1.96,14.18 5.55,14.18 6.84,15.48 13.62,15.48 16.52,12.58 16.52,4.58 CONN1.7
  Route15 0.152: v37.32,49.99 36.03,48.7 35.57,48.7 35.19,49.08 35.19,56.32 36.25,57.39 36.25,57.99 35.19,59.06 35.19,64.47 16.59,83.07 16.59,83.68 CONN2.13
  Bottom 0.152: v37.32,49.99 37.32,37.65 31,31.33 v31,30.49
DQ7  (via drill 0.38)
  Top 0.152: v19.11,25.84 20.25,25.84 IC2.50 20.33,25.76 21.09,25.76 22.31,24.54 23.22,24.54 25.89,27.21 v25.89,28.51 | v38.69,55.94 38.69,55.02 IC4.9 | v26.35,72.32 26.35,73.92 20.18,80.09 20.18,87.56 19.18,88.55 CONN2.16
  Route2 0.152: v26.35,72.32 33.13,65.54 33.13,62.41 34.04,61.5 34.04,60.36 36.56,57.84 36.94,57.84 37.4,57.39 37.4,57 38.46,55.94 v38.69,55.94 38.39,55.94 38.31,55.86 38.31,52.81 38.84,52.28 38.84,43.29 25.89,30.34 v25.89,28.51
  Bottom 0.152: v19.11,25.84 19.11,25.46 19.34,25.23 19.34,12.43 19.11,12.2 19.11,4.58 CONN1.32
DQ8  (via drill 0.38)
  Top 0.152: v38.92,53.96 39.45,54.49 39.45,54.95 IC4.11 | v27.26,73.46 20.63,80.09 20.63,89.01 21.24,89.62 25.74,89.62 26.73,88.63 CONN2.22 | v23.6,36.05 23.6,35.06 21.39,32.85 20.33,32.85 IC2.36 | v26.73,11.89 v26.73,9.53
  Route15 0.152: v29.62,42.07 v23.6,36.05
  Bottom 0.152: v38.92,53.96 38.62,53.96 37.43,55.14 | 37.43,55.14 34.04,58.53 34.04,61.5 32.29,63.25 32.29,68.44 v27.26,73.46 | 37.43,55.14 29.62,47.33 v29.62,42.07 29.62,31.02 36.25,24.39 36.25,22.56 26.73,13.04 v26.73,11.89 | v26.73,9.53 26.73,4.58 CONN1.35
DQ9  (via drill 0.38)
  Top 0.152: 40.37,49.54 40.37,47.63 v23.83,31.1 | 40.37,49.54 40.37,52.05 39.91,52.51 39.91,54.95 IC4.12 | v14.92,31.33 16.75,31.33 17.13,31.71 17.13,33.15 17.28,33.31 19.03,33.31 19.41,32.92 19.41,32.01 19.64,31.78 20.25,31.78 IC2.38 | v37.93,50.6 37.93,50.45 38.84,49.54 40.37,49.54
  Route2 0.152: v37.93,50.6 37.63,50.91 37.63,53.5 32.82,58.3 32.82,64.02 25.74,71.1 25.74,83.68 24.21,85.2 24.21,88.55 CONN2.20
  Route15 0.152: v22.39,14.56 22.39,25.69 23.83,27.13 v23.83,31.1
  Bottom 0.152: v23.83,31.1 15.15,31.1 v14.92,31.33 | v22.39,14.56 22.39,13.72 24.14,11.97 24.14,4.58 CONN1.34
DQ10  (via drill 0.38)
  Top 0.152: 40.29,54.03 40.29,52.59 40.67,52.2 40.67,45.96 v27.19,32.47 | 40.29,54.03 40.29,54.95 IC4.13 | v21.93,31.71 21.01,30.79 20.33,30.79 IC2.40 | v39.99,70.8 39.99,73.46 30.77,82.68 30.77,83.68 29.7,84.74 26.65,84.74 22.84,88.55 21.7,88.55 CONN2.18 | 40.29,54.03 v40.52,54.03
  Route15 0.152: v39.99,70.8 39.99,69.2 39.68,68.89 39.68,60.81 38.77,59.9 38.77,56.7 40.52,54.95 v40.52,54.03 | v21.24,15.7 21.24,22.18 20.86,22.56 20.86,25.99 21.17,26.3 21.17,30.94 v21.93,31.71
  Bottom 0.152: v27.19,32.47 25.2,32.47 24.44,31.71 v21.93,31.71 | v21.24,15.7 21.24,14.41 22.31,13.34 22.31,10.6 21.62,9.91 21.62,4.58 CONN1.33
DQ11  (via drill 0.38)
  Top 0.152: v42.27,50.76 42.27,53.12 40.75,54.64 40.75,54.95 IC4.14 | 24.02,32.51 21.32,29.8 20.33,29.8 IC2.42 | 24.02,32.51 v39.76,48.24 | v19.18,72.02 19.18,83.68 CONN2.15 | 24.02,32.51 v24.21,32.32 | v18.73,14.33 19.03,14.03 19.03,4.58 CONN1.8
  Route2 0.152: v39.76,48.24 v42.27,50.76 | v18.73,14.33 20.02,15.63 20.02,28.12 v24.21,32.32
  Bottom 0.152: v19.18,72.02 19.18,67.22 20.4,66 20.4,36.13 v24.21,32.32
DQ12  (via drill 0.38)
  Top 0.152: v21.78,27.44 21.01,28.2 20.33,28.2 IC2.45 | v19.72,11.97 19.72,11.12 21.55,9.29 21.55,4.58 CONN1.9 | v45.09,56.85 44.1,55.86 41.59,55.86 IC4.15 | 34.84,75.1 31.99,77.96 31.99,80.47 29.78,82.68 22.69,82.68 21.7,83.68 CONN2.17 | 34.84,75.1 v43.72,66.23 | v24.21,67.06 26.8,67.06 34.84,75.1
  Route2 0.152: v45.09,56.85 45.09,64.85 v43.72,66.23
  Bottom 0.152: v19.72,11.97 19.72,22.33 21.78,24.39 v21.78,27.44 25.66,27.44 27.8,29.57 27.8,54.26 24.21,57.84 v24.21,67.06
DQ13  (via drill 0.38)
  Top 0.152: v22.39,26.53 21.85,26.53 21.17,27.21 20.33,27.21 IC2.47 | v21.7,10.83 22.53,10.83 24.14,9.21 24.14,4.58 CONN1.10 | v43.42,56.47 43.19,56.24 41.59,56.24 IC4.16
  Route2 0.152: v22.39,26.53 23.99,26.53 25.36,27.9 26.12,27.9 40.44,42.22 40.44,45.5 v42.96,48.01
  Route15 0.152: v43.42,56.47 43.42,58.07 42.81,58.68 42.81,62.26 42.88,62.34 42.88,63.56 42.58,63.86 42.58,64.24 42.2,64.62 v41.36,64.62
  Bottom 0.152: v22.39,26.53 22.39,24.54 20.02,22.18 20.02,12.5 v21.7,10.83 | v41.36,64.62 41.36,75.83 34.5,82.68 33.97,82.68 32.82,83.83 32.82,84.21 32.29,84.74 25.2,84.74 CONN2.19 | v42.96,48.01 42.96,52.59 43.57,53.2 43.57,56.32 v43.42,56.47
DQ14  (via drill 0.38)
  Top 0.152: v22.99,25.15 22.16,25.15 21.09,26.22 20.33,26.22 IC2.49 | v44.25,56.85 44.03,57.08 43.19,57.08 42.73,56.62 41.59,56.62 IC4.17 | v43.65,67.98 43.65,73.01 32.82,83.83 32.82,85.05 29.32,88.55 CONN2.24
  Route15 0.152: v22.99,13.95 v22.99,25.15 24.82,25.15 40.14,40.47 40.37,40.47 43.57,43.67 43.57,55.78 44.25,56.47 v44.25,56.85 44.25,61.8 44.94,62.49 44.94,66 43.65,67.29 v43.65,67.98
  Bottom 0.152: v22.99,13.95 23.15,13.95 29.17,7.93 29.17,4.58 CONN1.36
DQ15  (via drill 0.38)
  Top 0.152: v18.42,24.85 18.8,25.23 20.25,25.23 IC2.51 | v17.89,16.01 18.73,16.01 26.65,8.08 26.65,4.58 CONN1.11 | v40.37,56.85 40.52,57 41.51,57 IC4.18
  Route15 0.152: v27.95,74.99 27.95,78.04 26.8,79.18 26.8,83.68 CONN2.21 | v18.42,24.85 18.42,26.22 20.56,28.35 20.56,33.69 22.31,35.44 33.66,35.44 41.21,42.98 41.28,42.98 41.66,43.36 41.66,55.56 v40.37,56.85
  Bottom 0.152: v18.42,24.85 18.42,16.54 v17.89,16.01 | v40.37,56.85 39.99,57.23 39.99,57.31 39.45,57.84 37.85,57.84 37.4,58.3 37.4,58.68 36.94,59.14 36.56,59.14 35.19,60.51 35.19,66.45 27.95,73.69 v27.95,74.99
EXT_CART
  Top 0.152: R15.2 1.89,15.7 3.03,15.7 3.94,16.62 46.77,16.62 47.76,17.61 52.64,17.61 62.24,8.01 62.24,4.58 CONN1.24
GND  (via drill 0.38)
  Top 0.152: CONN2.3 3.87,83.68 1.74,81.54 1.74,80.02 C9.2 1.74,79.94 1.74,77.81 C8.2 1.74,77.73 1.74,75.52 C6.2 1.81,75.45 2.8,74.45 4.33,74.45 4.36,74.49 | 4.36,74.49 6.38,76.51 6.38,83.68 CONN2.5 | CONN1.2 3.87,4.5 6.31,4.5 CONN1.3 6.38,4.58 6.38,8.01 v12.17,13.8 | C5.1 18.19,32.39 18.19,30.34 C2.2 18.12,30.26 16.06,30.26 C1.2 15.98,30.18 14.84,29.04 14.84,27.82 14.08,27.06 IC1.7 14.08,26.98 15.3,25.76 v15.3,25.46 | v16.9,23.86 18.27,23.86 19.18,24.77 20.25,24.77 IC2.52 | v10.8,28.28 10.8,27.06 IC1.2 | v7.45,33.84 6.15,35.13 C4.2 | C29.2 29.85,60.97 29.85,62.19 C37.2 | 34.27,65.46 33.05,65.46 C36.2 32.98,65.39 29.85,62.26 C37.2 | 34.27,65.46 v36.86,65.46 38.08,65.46 C32.2 | 34.27,65.46 C35.2 | C37.2 29.78,62.26 29.55,62.49 21.62,62.49 C39.2 21.55,62.57 14.08,62.57 12.71,63.94 10.88,63.94 10.73,64.09 10.73,65.77 | C30.2 28.56,57.16 28.56,55.94 C28.2 28.48,55.86 26.35,55.86 20.25,49.77 17.13,49.77 | J1.5 4.17,57.08 4.17,55.94 J1.S2 4.25,55.86 4.86,55.25 11.41,55.25 C40.2 11.41,55.18 11.87,55.18 17.13,49.92 17.13,49.77 | 10.73,65.77 10.8,65.77 12.1,67.06 U3.1 | 10.73,65.77 8.9,65.77 C38.2 8.82,65.69 8.82,65.54 4.25,60.97 J1.S1 | J1.S6 J1.S5 J1.S4 J1.S3 4.48,64.93 4.48,70.64 4.4,70.72 4.4,74.45 4.36,74.49 | 17.13,49.77 U4.4 | IC2.33 20.33,34.3 21.01,34.3 27.8,41.08 27.8,42.15 35.49,49.84 35.49,50.15 C31.2 35.42,50.15 v34.58,50.15 | S4.3 46.92,77.5 53.4,77.5 S4.4 53.4,77.58 59.49,83.68 59.72,83.68 CONN2.47 | 45.09,39.33 45.25,39.33 46.54,38.03 48.98,38.03 50.12,36.89 R17.1 50.2,36.89 51.42,38.11 v52.56,38.11 | v55.23,38.41 55.23,39.33 | v44.86,36.81 43.95,36.81 42.12,34.98 C11.1
  Top 0.152: v44.1,29.5 44.1,30.72 C10.1 | v39.3,52.66 40.06,51.9 40.06,50.91 39.38,50.22 C33.2 | 39.38,57.16 39.68,57.46 41.51,57.46 IC4.19 41.59,57.46 47.46,57.46 50.35,54.57 C41.2 | IC4.58 36.79,57.16 36.79,58.38 IC4.57 | IC4.57 36.79,58.45 IC4.59 36.79,58.53 36.79,59.67 IC4.60 36.86,59.75 38.08,59.75 | IC4.61 38.69,57.77 IC4.57 | 38.08,58.45 IC4.57 | IC4.65 39.3,58.38 38.77,57.84 IC4.57 | 38.08,59.75 39.3,59.75 IC4.66 | 38.08,59.75 IC4.63 | 39.38,57.16 IC4.64 | 39.38,57.16 IC4.57 | IC6.10 48.67,46.79 48.67,48.7 50.43,50.45 50.43,54.57 C41.2 | 56.79,56.59 57.51,57.31 Y2.4 | 56.79,56.59 56.75,56.55 55.91,56.55 C42.1 55.84,56.47 54.01,54.64 50.5,54.64 C41.2 | v58.73,47.48 58.73,46.79 IC7.10 | 56.79,56.59 v58.35,55.02 58.35,55.1 58.66,55.1 60.1,56.55 60.1,58.15 59.27,58.99 59.27,59.52 Y2.2 59.19,59.59 57.21,61.58 55.91,61.58 C43.1 55.84,61.65 55.23,62.26 50.27,62.26 C34.2 50.2,62.26 50.2,63.48 C27.2 50.2,63.56 50.5,63.86 v50.5,65.01 | v58.35,11.06 59.65,9.76 59.65,4.58 CONN1.23
  Route2 0.152: v55.23,38.41 55.23,40.09 58.73,43.59 v58.73,47.48
  Bottom 0.152: SW1.7 16.52,73.31 14.08,73.31 10.8,76.59 9.43,76.59 3.94,82.07 3.94,83.68 CONN2.3 | J1.S1 4.17,60.97 2.42,60.97 1.51,61.88 J1.S3 | J1.S6 1.51,54.95 2.42,55.86 4.17,55.86 J1.S2 4.17,55.78 7.45,52.51 v7.45,33.84 7.45,31.63 v10.8,28.28 12.48,28.28 v15.3,25.46 v16.9,23.86 16.82,23.86 12.17,19.21 v12.17,13.8 | v44.1,29.5 44.1,35.29 44.86,36.05 v44.86,36.81 51.27,36.81 v52.56,38.11 52.87,38.41 v55.23,38.41 55.3,38.41 58.35,35.36 v58.35,11.06 | S2.C2 24.82,75.6 36.71,75.6 S2.C1 36.79,75.52 36.79,74.84 38.16,73.46 38.16,65.46 | IC4.64 39.38,57.08 39.53,56.93 39.53,53.73 39.3,53.5 v39.3,52.66 37.09,52.66 v34.58,50.15 | v58.73,47.48 58.73,54.64 v58.35,55.02 | 38.16,65.46 38.16,59.82 38.08,59.75 IC4.63 | S4.4 53.4,77.05 50.2,73.84 50.2,65.31 v50.5,65.01 | 38.16,65.46 v36.86,65.46
  pour Top: -0.02,90.81 63.8,90.81 64.12,90.49 64.12,9.21 63.8,8.9 0.3,8.9 -0.02,8.58
  pour Bottom: -0.02,91.45 64.12,91.45 64.12,8.9 -0.02,8.9 -0.02,91.13
  pour Route2: -0.02,92.4 64.12,92.4 64.12,8.9 -0.02,8.9
  pour Route15: -0.02,93.35 64.12,93.35 64.12,8.9 -0.02,8.9
N$1  (via drill 0.38)
  Top 0.152: v8.44,54.64 9.58,53.5 9.58,49.54 R19.1 | v8.44,66.91 8.44,79.26 13.01,83.83 13.01,89.01 13.93,89.92 31.91,89.92 33.36,88.48 33.36,86.65 35.87,84.13 35.87,83.37 46.24,73.01 46.85,73.01 S4.1 46.92,73.01 S4.2
  Bottom 0.152: v8.44,66.91 v8.44,54.64
N$4  (via drill 2.4)
  other vias: 60.94,69.86
N$5  (via drill 2.4)
  other vias: 2.52,69.86
N$6  (via drill 2.4)
  other vias: 2.52,20.33
N$7  (via drill 2.4)
  other vias: 60.94,20.33
OE1  (via drill 0.38)
  Top 0.152: v34.58,61.8 35.34,62.57 36.03,62.57 36.25,62.34 36.25,61.88 IC4.40 | v41.05,52.66 41.05,48.47 42.73,46.79 IC6.11
  Route2 0.152: v34.58,61.8 34.58,61.12 36.71,58.99 37.09,58.99 37.47,58.6 37.47,58.22 37.93,57.77 38.31,57.77 38.77,57.31 38.77,56.7 39.91,55.56 39.91,53.8 v41.05,52.66
OE2  (via drill 0.38)
  Top 0.152: v35.8,60.89 35.87,60.97 35.87,61.8 IC4.41 | v51.65,46.87 52.79,46.87 52.87,46.79 IC7.11
  Route2 0.152: v35.8,60.89 36.41,60.28 37.02,60.28 37.47,59.82 37.47,59.52 38.01,58.99 38.31,58.99 38.77,58.53 38.77,58.22 39.23,57.77 40.22,57.77 40.52,57.46 41.05,57.46 v51.65,46.87
QSPI_SCLK  (via drill 0.38)
  Top 0.152: v35.64,57.77 35.34,57.46 34.65,57.46 IC4.52 | v24.6,56.17 17.74,56.17 17.43,55.86 16.82,55.86 15.91,56.78 15.91,56.93 U4.6
  Route15 0.152: v35.64,57.77 32.52,57.77 31.99,57.23 25.66,57.23 v24.6,56.17
QSPI_SD0
  Top 0.152: IC4.53 34.58,57.08 31.07,57.08 30.31,57.84 29.55,57.84 29.24,58.15 27.72,58.15 26.58,57 17.13,57 U4.5
QSPI_SD1
  Top 0.152: IC4.55 34.58,56.17 31.91,56.17 24.14,48.39 15.76,48.39 14.61,49.54 14.61,49.69 U4.2
QSPI_SD2  (via drill 0.38)
  Top 0.152: v30.69,56.62 34.58,56.62 IC4.54 | v29.62,54.87 25.81,54.87 19.64,48.7 16.75,48.7 15.91,49.54 15.91,49.69 U4.3
  Bottom 0.152: v30.69,56.62 29.62,55.56 v29.62,54.87
QSPI_SD3  (via drill 0.38)
  Top 0.152: v31.76,57.84 34.58,57.84 IC4.51 | v26.73,57.99 15.45,57.99 14.61,57.16 14.61,57 U4.7
  Bottom 0.152: v31.76,57.84 26.88,57.84 v26.73,57.99
QSPI_SS
  Top 0.152: R19.2 13.17,49.54 13.32,49.69 U4.1 13.32,49.61 14.84,48.09 24.29,48.09 31.99,55.78 34.58,55.78 IC4.56
RAM_CSB  (via drill 0.38)
  Top 0.152: v4.86,35.29 4.86,35.67 5.32,36.13 6.99,36.13 7.15,35.97 11.41,35.97 13.39,33.99 13.39,32.92 IC1.9 | v44.33,63.48 44.64,63.18 44.64,62.19 43.11,60.66 41.59,60.66 IC4.27 | v44.33,67.44 44.33,66 43.95,65.62 43.49,65.62 42.43,66.68 24.67,66.68 23.83,65.84 20.79,65.84 9.66,76.97 v9.66,79.1
  Route15 0.152: v4.86,35.29 4.86,37.34 9.66,42.15 v9.66,79.1
  Bottom 0.152: v4.86,35.29 4.86,33.69 3.34,32.16 3.34,30.26 3.03,29.95 3.03,22.56 4.48,21.11 4.48,5.19 3.87,4.58 CONN1.26 | v44.33,67.44 v44.33,63.48 | v9.66,79.1 5.24,83.52 5.24,87.26 3.94,88.55 CONN2.4
RAM_RWB  (via drill 0.38)
  Top 0.152: v13.77,25.76 13.32,25.76 12.78,26.3 12.78,26.98 IC1.5 | v10.57,20.96 4.63,20.96 3.26,22.33 1.74,22.33 1.7,22.3 | 1.7,22.3 0.52,21.11 0.52,5.34 1.28,4.58 CONN1.1 | v44.03,62.41 42.65,61.04 41.59,61.04 IC4.28 | v44.94,75.14 44.94,76.82 37.93,83.83 37.93,86.11 35.42,88.63 35.42,89.01 34.2,90.23 9.13,90.23 7.45,88.55 7.45,88.17 4.02,84.74 2.34,84.74 CONN2.1 1.28,83.68 0.36,82.76 0.36,29.73 1.66,28.43 1.66,22.33 1.7,22.3
  Bottom 0.152: v13.77,25.76 13.77,24.16 v10.57,20.96 | v44.03,62.41 44.48,62.87 44.56,62.87 44.94,63.25 v44.94,75.14
ROM0_1  (via drill 0.38)
  Top 0.152: v46.54,64.09 44.1,64.09 43.72,63.71 43.72,63.18 42.43,61.88 40.75,61.88 IC4.29 | v47.46,71.1 53.7,71.1 53.74,71.14 | 53.74,71.14 61.25,78.65 61.25,87.56 62.24,88.55 CONN2.50 | v9.96,28.28 9.96,28.58 11.41,30.03 11.41,32.85 IC1.12 | v10.88,17.76 47.46,17.76 47.61,17.91 53.17,17.91 53.21,17.88 | v60.33,10.75 53.21,17.88 | 53.21,17.88 62.31,26.98 62.31,43.75 62.24,43.82 62.24,59.14 53.78,67.6 53.78,71.1 53.74,71.14
  Bottom 0.152: v46.54,64.09 46.54,70.19 v47.46,71.1 | v9.96,28.28 9.96,18.68 v10.88,17.76 | v60.33,10.75 60.33,10.17 62.24,8.26 62.24,4.58 CONN1.48
ROM_CSB2  (via drill 0.38)
  Top 0.152: v41.97,64.02 41.97,63.18 41.59,62.8 40.75,62.8 40.29,62.34 40.29,61.88 IC4.30 | v2.8,81.24 5.39,83.83 5.39,85.05 8.9,88.55 CONN2.8
  Bottom 0.152: v41.97,64.02 41.97,77.27 35.42,83.83 35.42,84.13 31.99,87.56 9.96,87.56 8.97,88.55 CONN2.8 | v2.8,81.24 0.36,78.8 0.36,54.64 5.47,49.54 5.47,33.15 8.9,29.73 8.9,4.58 CONN1.28
SENSE  (via drill 0.38)
  Top 0.152: v5.32,14.79 4.48,15.63 R16.2
  Bottom 0.152: v5.32,14.79 5.32,10.01 6.31,9.02 6.31,4.58 CONN1.27
USB1_N
  Top 0.152: R21.1 30.96,59.65 31.4,59.21 31.66,59.21 32.22,59.78 33.52,59.78 33.56,59.83 IC4.46
USB1_P
  Top 0.152: R20.1 30.96,58.48 31.4,58.91 31.78,58.91 32.35,59.48 33.28,59.48 33.33,59.43 IC4.47
USB_N
  Top 0.406: J1.2 5.75,59.08 6.02,59.34 29.66,59.34 29.96,59.65 R21.2
USB_P
  Top 0.406: J1.3 6.16,58.43 6.52,58.78 29.66,58.78 29.96,58.48 R20.2
VBUS
  Top 0.152: J1.1 4.25,59.75 4.78,59.75 8.82,63.79 C38.1 8.9,63.79 10.19,62.49 12.1,62.49 U3.3
VCC  (via drill 0.38)
  Top 0.152: 48.45,31.78 48.6,31.78 R5.2 48.45,31.78 | 48.45,31.78 46.46,31.78 R8.2 46.39,31.78 45.74,32.43 | 45.74,32.43 45.17,33 44.25,33 R9.2 | 48.45,31.78 48.45,29.57 R14.2 | 15.98,27.21 15.98,25.3 15.45,24.77 13.7,24.77 | 15.98,27.21 15.98,28.35 C1.1 | 13.7,24.77 12.71,24.77 R2.2 | 13.7,24.77 13.7,22.03 13.55,21.88 11.79,21.88 10.88,22.79 10.5,22.79 R1.2 10.35,22.87 10.35,23.02 5.85,27.52 5.85,30.26 6.42,30.83 | v17.43,27.21 18.12,27.9 18.12,28.35 C2.1 18.19,28.43 18.5,28.43 19.34,29.27 20.25,29.27 IC2.43 20.33,29.34 23.3,29.34 25.05,31.1 31.22,31.1 32.29,30.03 v33.97,30.03 | 15.98,27.21 v16.21,27.21 | 45.74,32.43 45.17,31.86 v45.09,31.86 | v3.64,29.73 2.42,29.73 D1.3 | 6.42,30.83 5.85,31.4 5.85,32.92 C4.1 6.08,33.23 5.7,32.85 v4.86,32.85 4.86,34.45 4.25,35.06 4.25,35.52 5.62,36.89 8.36,36.89 R4.2 8.44,36.96 10.57,36.96 R3.2 10.65,36.96 14.92,36.96 | 6.42,30.83 7.22,30.03 7.98,30.03 10.12,32.16 10.12,32.85 IC1.14 | R10.2 31,79.56 31,77.58 R11.2 31,75.45 R12.2 31,75.37 31,73.39 R13.2 31.07,73.31 31.07,71.79 26.96,67.67 22.23,67.67 v21.01,66.45 | IC2.29 20.25,36.28 18.42,36.28 16.29,38.41 16.06,38.41 R7.2 | 14.92,36.96 14.92,37.34 15.98,38.41 R7.2 | 14.92,36.96 14.92,35.82 15.98,34.75 15.98,34.37 R6.2 | v21.01,43.52 21.01,43.06 16.37,38.41 R7.2
  Bottom 0.152: v16.21,27.21 v17.43,27.21 | v45.09,31.86 45.09,29.65 44.33,28.89 39.99,28.89 38.84,30.03 v33.97,30.03 | v3.64,29.73 3.64,31.63 v4.86,32.85 | v21.01,43.52 v21.01,66.45
VDD_EXT  (via drill 0.38)
  Top 0.152: R15.1 1.89,17.38 v2.95,17.38 4.4,17.38 R16.1 | v2.73,30.72 4.55,30.72 D1.2
  Bottom 0.152: v2.73,30.72 2.73,23.32 0.52,21.11 0.52,17.38 | 0.52,17.38 0.52,5.34 1.28,4.58 CONN1.25 | 0.52,17.38 v2.95,17.38
XIN
  Top 0.152: IC4.20 41.59,57.84 55.84,57.84 C42.2 55.91,57.84 56.37,58.3 58.28,58.3 59.19,57.39 Y2.1
XOUT
  Top 0.152: R22.2 46.31,60.97 43.57,58.22 41.59,58.22 IC4.21
XOUT2
  Top 0.152: R22.1 55.23,60.97 55.84,60.36 C43.2 55.91,60.28 56.6,59.59 57.51,59.59 Y2.3

## Text on the board
tPlace: Latch | Off | On
bPlace: DISCO-CART IIIe | RetroSpy Technologies / retro-spy.com